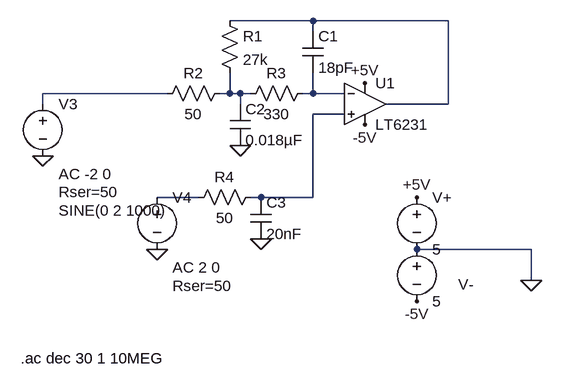
[diagram p0: schematic MF_LPF.asc]
MF_LPF.asc, the LTspice schematic file:
Version 4
SHEET 1 940 680
WIRE 176 0 48 0
WIRE 384 0 176 0
WIRE 176 16 176 0
WIRE -48 112 -240 112
WIRE 48 112 48 80
WIRE 48 112 32 112
WIRE 64 112 48 112
WIRE 80 112 64 112
WIRE 176 112 176 80
WIRE 176 112 160 112
WIRE 224 112 176 112
WIRE -240 128 -240 112
WIRE 64 128 64 112
WIRE 384 128 384 0
WIRE 384 128 288 128
WIRE 224 144 176 144
WIRE 0 272 -64 272
WIRE 96 272 80 272
WIRE 176 272 176 144
WIRE 176 272 96 272
WIRE 512 352 336 352
WIRE 512 400 512 352
FLAG 336 272 +5V
FLAG 336 432 -5V
FLAG 256 160 -5V
FLAG 256 96 +5V
FLAG -240 208 0
FLAG 96 336 0
FLAG 64 192 0
FLAG -64 352 0
FLAG 512 400 0
SYMBOL Opamps\\LT6231 256 128 R0
SYMATTR InstName U1
SYMBOL voltage 336 336 R0
WINDOW 0 64 70 Left 2
SYMATTR InstName V-
SYMATTR Value 5
SYMBOL voltage 336 256 R0
SYMATTR InstName V+
SYMATTR Value 5
SYMBOL cap 160 16 R0
SYMATTR InstName C1
SYMATTR Value 18pF
SYMBOL res 32 -16 R0
SYMATTR InstName R1
SYMATTR Value 27k
SYMBOL res 48 96 R90
WINDOW 0 0 56 VBottom 2
WINDOW 3 32 56 VTop 2
SYMATTR InstName R2
SYMATTR Value 50
SYMBOL res 176 96 R90
WINDOW 0 0 56 VBottom 2
WINDOW 3 32 56 VTop 2
SYMATTR InstName R3
SYMATTR Value 330
SYMBOL cap 48 128 R0
SYMATTR InstName C2
SYMATTR Value 0.018µF
SYMBOL cap 80 272 R0
SYMATTR InstName C3
SYMATTR Value 20nF
SYMBOL res 96 256 R90
WINDOW 0 0 56 VBottom 2
WINDOW 3 32 56 VTop 2
SYMATTR InstName R4
SYMATTR Value 50
SYMBOL voltage -240 112 R0
WINDOW 3 24 180 Left 2
WINDOW 123 24 124 Left 2
WINDOW 39 24 152 Left 2
SYMATTR InstName V3
SYMATTR Value SINE(0 2 1000)
SYMATTR Value2 AC -2 0
SYMATTR SpiceLine Rser=50
SYMBOL voltage -64 256 R0
WINDOW 123 24 124 Left 2
WINDOW 39 24 152 Left 2
SYMATTR InstName V4
SYMATTR Value ""
SYMATTR Value2 AC 2 0
SYMATTR SpiceLine Rser=50
TEXT -274 520 Left 2 !.ac dec 30 1 10MEG

The netlist it stands for:
* MF_LPF.asc
XU1 N005 N004 N001 +5V -5V LT6231  ; pins In+ In- OUT V+ V-
V- 0 -5V 5
V+ +5V 0 5
C1 N001 N004 18pF
R1 N001 N003 27k
R2 N003 N002 50
R3 N004 N003 330
C2 N003 0 0.018µF
C3 N005 0 20nF
R4 N005 N006 50
V3 N002 0 SINE(0 2 1000) AC -2 0 Rser=50
V4 N006 0 AC 2 0 Rser=50
.ac dec 30 1 10MEG
.lib LTC2.lib
.backanno
.end